# Altium schematic sheet Power.SCHDOC: FPGA Rack
size 420 x 297 mm; DrawnBy: zas; Revision: V1.0; SheetNumber: 3; SheetTotal: 25; DocumentName: Power.SCHDOC
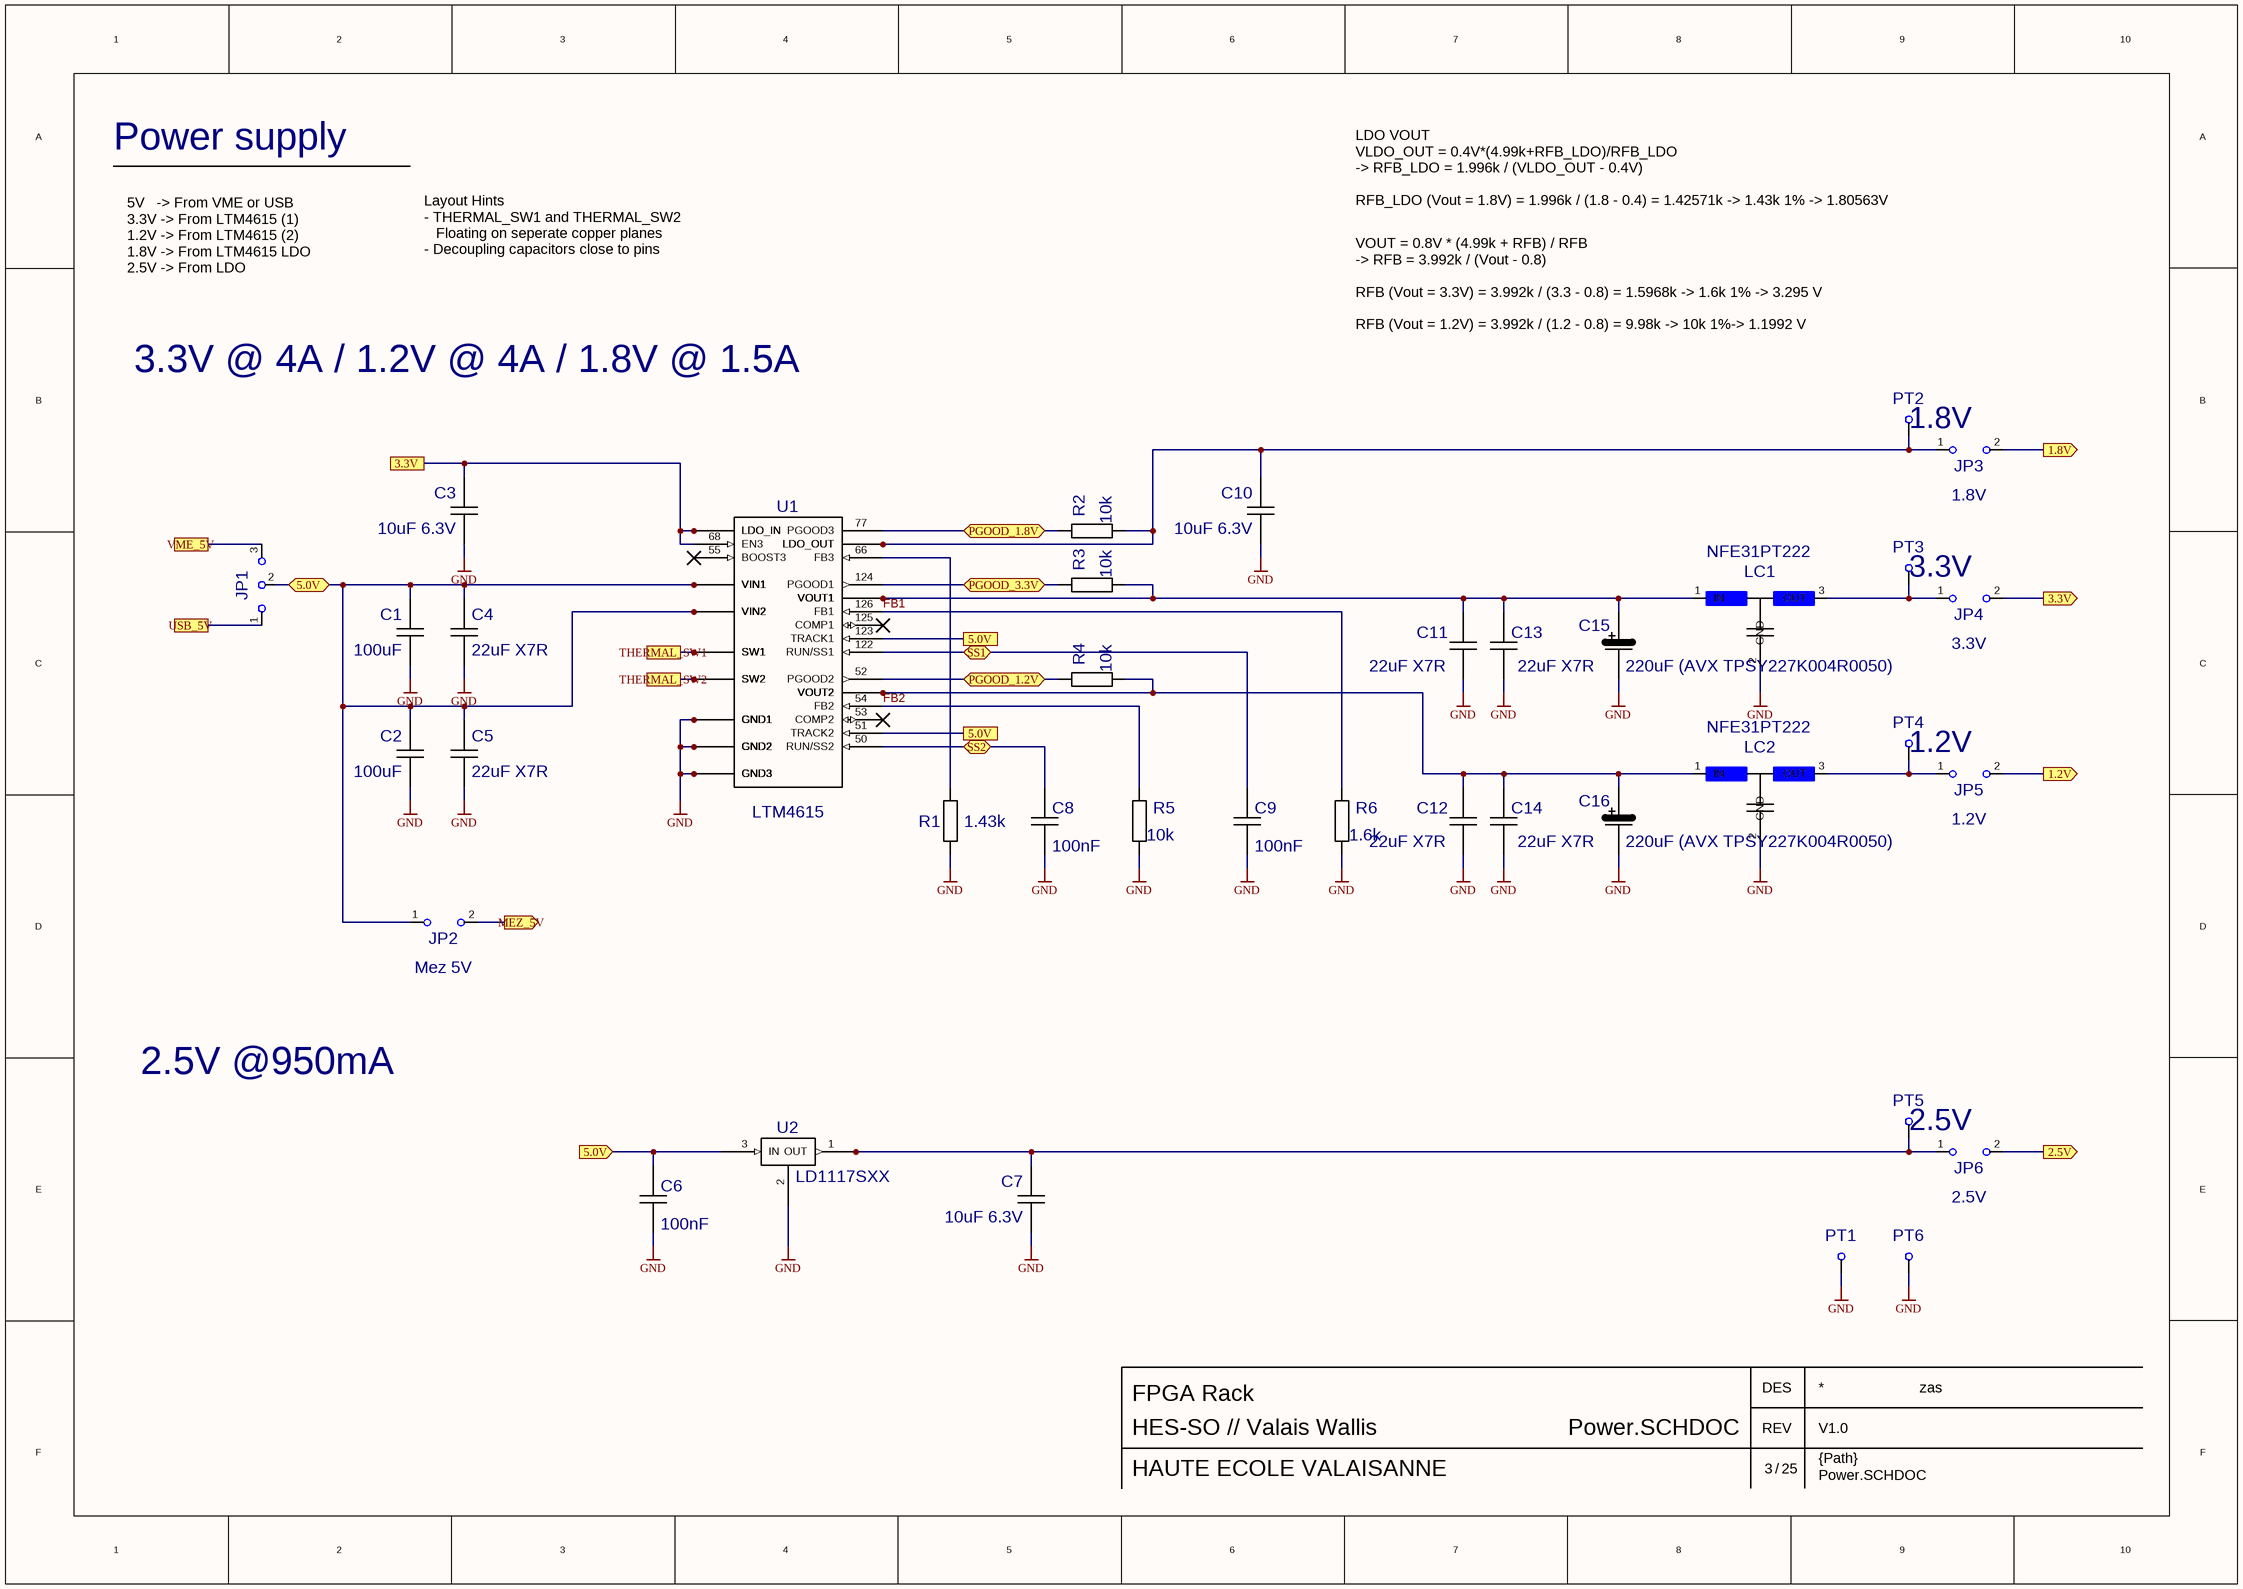
[diagram p0: Power.SCHDOC]

## Parts
C1  value 100uF  [CC1206]  (hidden comment: CAPS1206)
C2  value 100uF  [CC1206]  (hidden comment: CAPS1206)
C3  value 10uF 6.3V  [CC0805]  (hidden comment: CAPS0805)
C4  value 22uF X7R  [CC1206]  (hidden comment: CAPS1206)
C5  value 22uF X7R  [CC1206]  (hidden comment: CAPS1206)
C6  value 100nF  [CC0805]  (hidden comment: CAPS0805)
C7  value 10uF 6.3V  [CC0805]  (hidden comment: CAPS0805)
C8  value 100nF  [RC0603/0805]  (hidden comment: CAPS0603/0805)
C9  value 100nF  [RC0603/0805]  (hidden comment: CAPS0603/0805)
C10  value 10uF 6.3V  [CC0805]  (hidden comment: CAPS0805)
C11  value 22uF X7R  [CC1206]  (hidden comment: CAPS1206)
C12  value 22uF X7R  [CC1206]  (hidden comment: CAPS1206)
C13  value 22uF X7R  [CC1206]  (hidden comment: CAPS1206)
C14  value 22uF X7R  [CC1206]  (hidden comment: CAPS1206)
C15  value 220uF (AVX TPSY227K004R0050)  [TC7343]  (hidden comment: CAPS7343P(TAJ-D))
C16  value 220uF (AVX TPSY227K004R0050)  [TC7343]  (hidden comment: CAPS7343P(TAJ-D))
JP1  JUMPER-3  [JUMPER3]  (value not drawn)
JP2  value Mez 5V  [JUMPER-SMD]  (hidden comment: JUMPER-SMD)
JP3  value 1.8V  [JUMPER-SMD]  (hidden comment: JUMPER-SMD)
JP4  value 3.3V  [JUMPER-SMD]  (hidden comment: JUMPER-SMD)
JP5  value 1.2V  [JUMPER-SMD]  (hidden comment: JUMPER-SMD)
JP6  value 2.5V  [JUMPER-SMD]  (hidden comment: JUMPER-SMD)
LC1  value NFE31PT222  [NFE31P]  (hidden comment: NFE31P)
LC2  value NFE31PT222  [NFE31P]  (hidden comment: NFE31P)
PT1  PTEST  [CONN1X1M]  (value not drawn)
PT2  value 1.8V  [CONN1X1M]  (hidden comment: PTEST)
PT3  value 3.3V  [CONN1X1M]  (hidden comment: PTEST)
PT4  value 1.2V  [CONN1X1M]  (hidden comment: PTEST)
PT5  value 2.5V  [CONN1X1M]  (hidden comment: PTEST)
PT6  PTEST  [CONN1X1M]  (value not drawn)
R1  value 1.43k  [RC0603/0805]  (hidden comment: RS0603/0805)
R2  value 10k  [RC0603/0805]  (hidden comment: RS0603/0805)
R3  value 10k  [RC0603/0805]  (hidden comment: RS0603/0805)
R4  value 10k  [RC0603/0805]  (hidden comment: RS0603/0805)
R5  value 10k  [RC0603/0805]  (hidden comment: RS0603/0805)
R6  value 1.6k  [RC0603/0805]  (hidden comment: RS0603/0805)
U1  LTM4615  [LGA144_15X15MM]
U2  LD1117SXX  [SOT223]

## Ports
1.2V (out), 1.8V (out), 2.5V (out), 3.3V, 3.3V (out), 5.0V, 5.0V (bidir), 5.0V (in), MEZ_5V (out), PGOOD_1.2V (bidir), PGOOD_1.8V (bidir), PGOOD_3.3V (bidir), SS1 (bidir), SS2 (bidir), THERMAL_SW1, THERMAL_SW2, USB_5V, VME_5V

## Nets
GND: C1.1 C2.1 C3.1 C4.1 C5.1 C6.1 C7.1 C8.1 C9.1 C10.1 C11.1 C12.1 C13.1 C14.1 C15.MINUS(-) C16.MINUS(-) LC1.2(GND) LC2.2(GND) PT1.1(A) PT6.1(A) R1.1 R5.1 R6.1 U1.1(GND2) U1.2(GND2) U1.3(GND2) U1.4(GND2) U1.5(GND2) U1.6(GND2) U1.7(GND2) U1.8(GND2) U1.9(GND2) U1.10(GND2) U1.11(GND2) U1.12(GND2) U1.13(GND2) U1.19(GND2) U1.20(GND2) U1.21(GND2) U1.22(GND2) U1.23(GND2) U1.24(GND2) U1.31(GND2) U1.32(GND2) U1.42(GND2) U1.43(GND2) U1.44(GND2) U1.49(GND2) U1.56(GND2) U1.57(GND2) U1.58(GND2) U1.61(GND3) U1.62(GND3) U1.63(GND3) U1.64(GND3) U1.65(GND3) U1.67(GND3) U1.69(GND3) U1.70(GND3) U1.71(GND3) U1.72(GND3) U1.78(GND3) U1.79(GND3) U1.80(GND3) U1.85(GND1) U1.91(GND1) U1.92(GND1) U1.93(GND1) U1.94(GND1) U1.95(GND1) U1.96(GND1) U1.102(GND1) U1.103(GND1) U1.104(GND1) U1.105(GND1) U1.106(GND1) U1.107(GND1) U1.108(GND1) U1.114(GND1) U1.115(GND1) U1.116(GND1) U1.121(GND1) U1.127(GND1) U1.128(GND1) U1.133(GND1) U1.134(GND1) U1.135(GND1) U1.136(GND1) U1.137(GND1) U1.138(GND1) U1.139(GND1) U1.140(GND1) U2.2(GND)
1.2V: JP5.2 ; port 1.2V
1.8V: JP3.2 ; port 1.8V
2.5V: JP6.2 ; port 2.5V
3.3V: C3.2 JP4.2 U1.68(EN3) U1.73(LDO_IN) U1.74(LDO_IN) U1.75(LDO_IN) U1.76(LDO_IN) ; port 3.3V
5.0V: C1.2 C2.2 C4.2 C5.2 C6.2 JP1.2 JP2.1 U1.25(VIN2) U1.26(VIN2) U1.27(VIN2) U1.28(VIN2) U1.29(VIN2) U1.30(VIN2) U1.37(VIN2) U1.38(VIN2) U1.39(VIN2) U1.40(VIN2) U1.41(VIN2) U1.51(TRACK2) U1.97(VIN1) U1.98(VIN1) U1.99(VIN1) U1.100(VIN1) U1.101(VIN1) U1.109(VIN1) U1.110(VIN1) U1.111(VIN1) U1.112(VIN1) U1.113(VIN1) U1.123(TRACK1) U2.3(IN) ; port 5.0V
FB1: R6.2 U1.126(FB1)
FB2: R5.2 U1.54(FB2)
MEZ_5V: JP2.2 ; port MEZ_5V
PGOOD_1.2V: R4.2 U1.52(PGOOD2) ; port PGOOD_1.2V
PGOOD_1.8V: R2.2 U1.77(PGOOD3) ; port PGOOD_1.8V
PGOOD_3.3V: R3.2 U1.124(PGOOD1) ; port PGOOD_3.3V
SS1: C9.2 U1.122(RUN/SS1) ; port SS1
SS2: C8.2 U1.50(RUN/SS2) ; port SS2
THERMAL_SW1: U1.86(SW1) U1.87(SW1) U1.88(SW1) U1.89(SW1) U1.90(SW1) ; port THERMAL_SW1
THERMAL_SW2: U1.14(SW2) U1.15(SW2) U1.16(SW2) U1.17(SW2) U1.18(SW2) ; port THERMAL_SW2
USB_5V: JP1.1 ; port USB_5V
VME_5V: JP1.3 ; port VME_5V
NetC7_2: C7.2 JP6.1 PT5.1(A) U2.1(OUT) U2.4(OUT)
NetC10_2: C10.2 JP3.1 PT2.1(A) R2.1 U1.81(LDO_OUT) U1.82(LDO_OUT) U1.83(LDO_OUT) U1.84(LDO_OUT)
NetC11_2: C11.2 C13.2 C15.PLUS(+) LC1.1(IN) R3.1 U1.117(VOUT1) U1.118(VOUT1) U1.119(VOUT1) U1.120(VOUT1) U1.129(VOUT1) U1.130(VOUT1) U1.131(VOUT1) U1.132(VOUT1) U1.141(VOUT1) U1.142(VOUT1) U1.143(VOUT1) U1.144(VOUT1)
NetC12_2: C12.2 C14.2 C16.PLUS(+) LC2.1(IN) R4.1 U1.33(VOUT2) U1.34(VOUT2) U1.35(VOUT2) U1.36(VOUT2) U1.45(VOUT2) U1.46(VOUT2) U1.47(VOUT2) U1.48(VOUT2) U1.59(VOUT2) U1.60(VOUT2)
NetJP4_1: JP4.1 LC1.3(OUT) PT3.1(A)
NetJP5_1: JP5.1 LC2.3(OUT) PT4.1(A)
NetR1_2: R1.2 U1.66(FB3)

Not connected (* = marked no-connect by the designer): U1 53(COMP2) 55(BOOST3) 125(COMP1)

## Notes on the sheet
- Power supply
- LDO VOUT
  VLDO_OUT = 0.4V*(4.99k+RFB_LDO)/RFB_LDO
  -> RFB_LDO = 1.996k / (VLDO_OUT - 0.4V)
  RFB_LDO (Vout = 1.8V) = 1.996k / (1.8 - 0.4) = 1.42571k -> 1.43k 1% -> 1.80563V
- 5V   -> From VME or USB
  3.3V -> From LTM4615 (1)
  1.2V -> From LTM4615 (2)
  1.8V -> From LTM4615 LDO
  2.5V -> From LDO
- Layout Hints
  - THERMAL_SW1 and THERMAL_SW2
  Floating on seperate copper planes
  - Decoupling capacitors close to pins
- 3.3V @ 4A / 1.2V @ 4A / 1.8V @ 1.5A
- VOUT = 0.8V * (4.99k + RFB) / RFB
  -> RFB = 3.992k / (Vout - 0.8)
  RFB (Vout = 3.3V) = 3.992k / (3.3 - 0.8) = 1.5968k -> 1.6k 1% -> 3.295 V
  RFB (Vout = 1.2V) = 3.992k / (1.2 - 0.8) = 9.98k -> 10k 1%-> 1.1992 V
- 2.5V @950mA
- DES
- HES-SO // Valais Wallis
- HAUTE ECOLE VALAISANNE
- /
- REV
- {Path}

## Library data of the parts
C1 C2 C4 C5 C11-C14 = CAPS1206: Capacitor
C3 C6 C7 C10 = CAPS0805: Capacitor
C8 C9 = CAPS0603/0805: Valable pour formats 0805 et 1206
JP2-JP6 = JUMPER-SMD: use: power supply 3.3
LC1 LC2 = NFE31P: EMI filter - TDK; use: power supply 3.3
PT1-PT6 = PTEST: Partition: Power; RefDes2: {RefDes2}; MEZZAONLY: YES
R1-R6 = RS0603/0805: Valable pour format 0805 et 1206
U2 = LD1117SXX: 3A Low Dropout positive Regulator; Value: *
U1 = LTM4615: Value: *